# Altium schematic sheet GCMProto.SchDoc
size B; SheetNumber: 1; SheetTotal: 1; SPICEModelCacheAHAKVLQQ: <root> / <DocumentId>AHAKVLQQ</DocumentId> / </root>
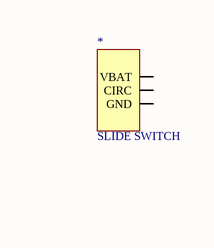
[diagram p0: GCMProto.SchDoc, top right]
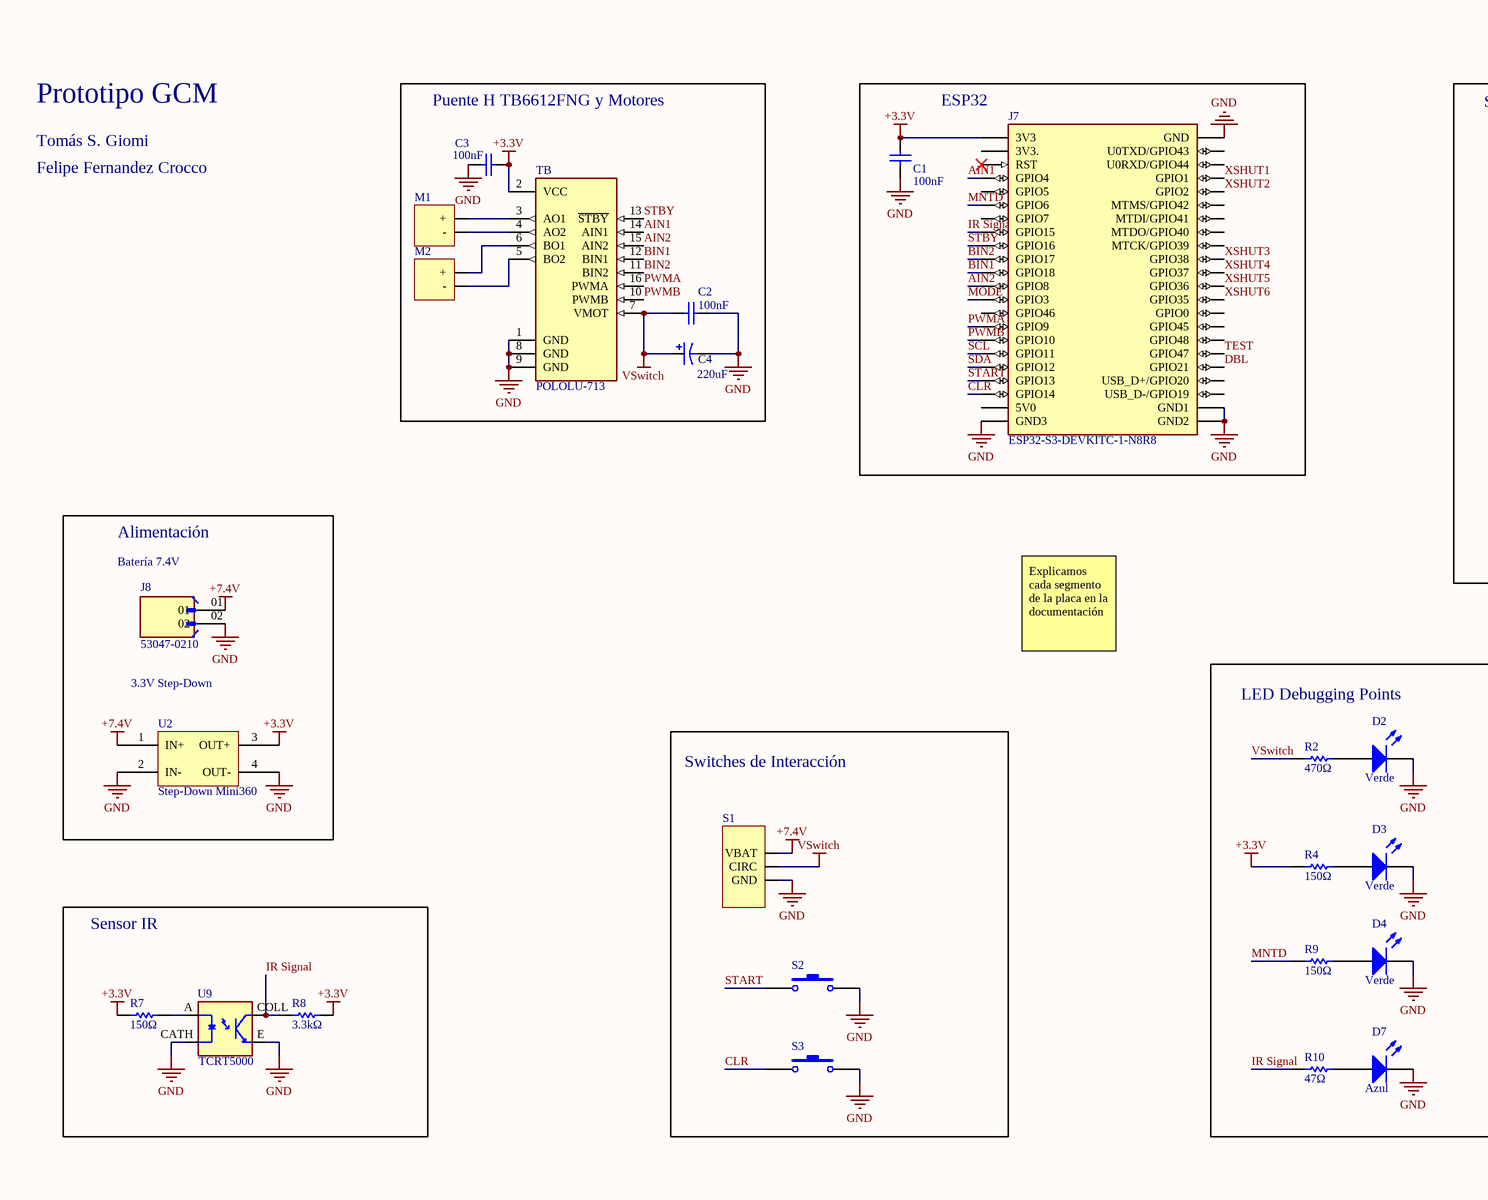
[diagram p1: GCMProto.SchDoc, bottom left]
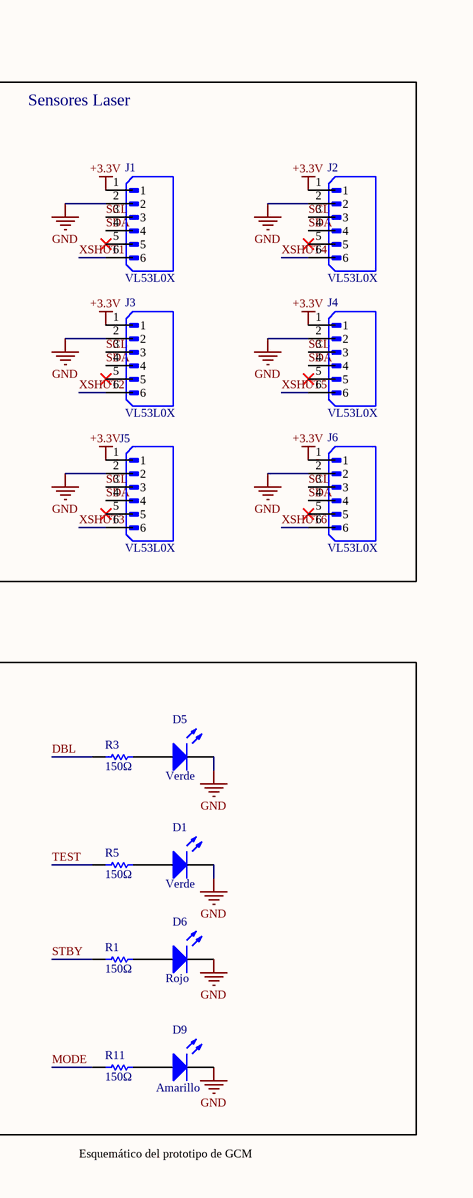
[diagram p2: GCMProto.SchDoc, bottom right]

## Parts
*  SLIDE SWITCH  [Slide Switch]
C1  Cap Ceramico  [Cap Ceramico]  (value not drawn)
C2  100nf  [Cap Ceramico]  (value not drawn)
C3  Cap Ceramico  [Cap Ceramico]  (value not drawn)
C4  220 uF  [Cap El 220 uF]  (value not drawn)
D1  (no value)  [LED]
D2  (no value)  [LED]
D3  (no value)  [LED]
D4  (no value)  [LED]
D5  (no value)  [LED]
D6  (no value)  [LED]
D7  (no value)  [LED]
D9  (no value)  [LED]
J1  VL53L0X  [JST_B6B-PH-K-S(LF)(SN)]
J2  VL53L0X  [JST_B6B-PH-K-S(LF)(SN)]
J3  VL53L0X  [JST_B6B-PH-K-S(LF)(SN)]
J4  VL53L0X  [JST_B6B-PH-K-S(LF)(SN)]
J5  VL53L0X  [JST_B6B-PH-K-S(LF)(SN)]
J6  VL53L0X  [JST_B6B-PH-K-S(LF)(SN)]
J7  ESP32-S3-DEVKITC-1-N8R8  [ESP32-S3-DEVKITC-1-N8R8]
J8  53047-0210  [MOLEX_53047-0210]
M1  (no value)  [MOTOR]
M2  (no value)  [MOTOR]
R1  150Ω  [Res_0.25W]
R2  470Ω  [Res_0.25W]
R3  150Ω  [Res_0.25W]
R4  150Ω  [Res_0.25W]
R5  150Ω  [Res_0.25W]
R7  150Ω  [Res_0.25W]
R8  3.3kΩ  [Res_0.25W]
R9  150Ω  [Res_0.25W]
R10  47Ω  [Res_0.25W]
R11  150Ω  [Res_0.25W]
S1  (no value)  [Slide Switch]
S2  (no value)  [Pulsador]
S3  (no value)  [Pulsador]
TB  POLOLU-713  [SHIELD_POLOLU-713]
U2  Step-Down Mini360  [Step-Down]  (no BOM)
U9  (no value)  [OPTO_TCRT5000]

## Blocks framed on the sheet
Sensores Laser: J1-J6
LED Debugging Points: D1-D7 D9 R1-R5 R9-R11
Switches de Interacción: S1-S3
Sensor IR: R7 R8 U9

## Nets
+3.3V: C1.2 C3.2 J1.1 J2.1 J3.1 J4.1 J5.1 J6.1 J7.J1_1(3V3) R4.1 R7.1 R8.2 TB.2(VCC) U2.3(OUT+)
+7.4V: J8.01 S1.0(VBAT) U2.1(IN+)
GND: C1.1 C2.2 C3.1 C4.2 D1.1(K) D2.1(K) D3.1(K) D4.1(K) D5.1(K) D6.1(K) D7.1(K) D9.1(K) J1.2 J2.2 J3.2 J4.2 J5.2 J6.2 J7.J1_22(GND3) J7.J3_1(GND) J7.J3_21(GND1) J7.J3_22(GND2) J8.02 S1.2(GND) S2.2 S3.2 TB.1(GND) TB.8(GND) TB.9(GND) U2.2(IN-) U2.4(OUT-) U9.CATH U9.E
VSwitch: C2.1 C4.1 R2.1 S1.1(CIRC) TB.7(VMOT)
AIN1: J7.J1_4(GPIO4) TB.14(AIN1)
AIN2: J7.J1_12(GPIO8) TB.15(AIN2)
BIN1: J7.J1_11(GPIO18) TB.12(BIN1)
BIN2: J7.J1_10(GPIO17) TB.11(BIN2)
CLR: J7.J1_20(GPIO14) S3.1
DBL: J7.J3_18(GPIO21) R3.1
IR Signal: J7.J1_8(GPIO15) R8.1 R10.1 U9.COLL
MNTD: J7.J1_6(GPIO6) R9.1
MODE: J7.J1_13(GPIO3) R11.1
PWMA: J7.J1_15(GPIO9) TB.16(PWMA)
PWMB: J7.J1_16(GPIO10) TB.10(PWMB)
SCL: J1.3 J2.3 J3.3 J4.3 J5.3 J6.3 J7.J1_17(GPIO11)
SDA: J1.4 J2.4 J3.4 J4.4 J5.4 J6.4 J7.J1_18(GPIO12)
START: J7.J1_19(GPIO13) S2.1
STBY: J7.J1_9(GPIO16) R1.1 TB.13(~{STBY})
TEST: J7.J3_17(GPIO47) R5.1
XSHUT1: J1.6 J7.J3_4(GPIO1)
XSHUT2: J3.6 J7.J3_5(GPIO2)
XSHUT3: J5.6 J7.J3_10(GPIO38)
XSHUT4: J2.6 J7.J3_11(GPIO37)
XSHUT5: J4.6 J7.J3_12(GPIO36)
XSHUT6: J6.6 J7.J3_13(GPIO35)
NetD1_0: D1.0(A) R5.2
NetD2_0: D2.0(A) R2.2
NetD3_0: D3.0(A) R4.2
NetD4_0: D4.0(A) R9.2
NetD5_0: D5.0(A) R3.2
NetD6_0: D6.0(A) R1.2
NetD7_0: D7.0(A) R10.2
NetD9_0: D9.0(A) R11.2
NetM1_+: M1.+ TB.3(AO1)
NetM1_-: M1.- TB.4(AO2)
NetM2_+: M2.+ TB.6(BO1)
NetM2_-: M2.- TB.5(BO2)
NetR7_2: R7.2 U9.A

Not connected (* = marked no-connect by the designer): * 0(VBAT) 1(CIRC) 2(GND); J1 5*; J2 5*; J3 5*; J4 5*; J5 5*; J6 5*; J7 J1_2(3V3.) J1_3(RST)* J1_5(GPIO5) J1_7(GPIO7) J1_14(GPIO46) J1_21(5V0) J3_2(U0TXD/GPIO43) J3_3(U0RXD/GPIO44) J3_6(MTMS/GPIO42) J3_7(MTDI/GPIO41) J3_8(MTDO/GPIO40) J3_9(MTCK/GPIO39) J3_14(GPIO0) J3_15(GPIO45) J3_16(GPIO48) J3_19(USB_D+/GPIO20) J3_20(USB_D-/GPIO19)

## Notes on the sheet
- Tomás S. Giomi
- Prototipo GCM
- Puente H TB6612FNG y Motores
- (near C3) 100nF
- ESP32
- Felipe Fernandez Crocco
- (near C1) 100nF
- (near C2) 100nF
- (near C4) 220uF
- Alimentación
- (near J8) Batería 7.4V
- 3.3V Step-Down
- Explicamos cada segmento de la placa en la documentación
- (near D2) Verde
- (near D5) Verde
- (near D3) Verde
- (near D1) Verde
- (near D4) Verde
- (near D6) Rojo
- (near U9) TCRT5000
- (near D7) Azul
- (near D9) Amarillo
- Esquemático del prototipo de GCM

## Library data of the parts
C2 = Cap Ceramico
C4 = CAP EL 220 uF
D1-D7 D9 = LED: Published: 8-Jun-2000; LatestRevisionDate: 08-Jul-2005; LatestRevisionNote: Mech Layer 1 removed.; PackageReference: LED-0; Publisher: Altium Limited; PackageDescription: LED; 2 Leads
J1-J6 = B6B-PH-K-S(LF)(SN): MF: {'manufacturer': u'JST Sales America Inc.'}; Package: None; Price: None; Value: *; MP: B6B-PH-K-S(LF)(SN); Availability: Unavailable; LCSC Part Number: C131342
J7 = ESP32-S3-DEVKITC-1-N8R8: The ESP32-S3-DEVKITC-1-N8R8 from Espressif Systems is a development board designed for RF, RFID, and wireless applications. It supports 802.11 b/g/n Wi-Fi and BluetoothÂ® 5.x (BLE) connectivity at 2.4GHz, making it ideal for IoT and wireless communication; SnapEDA_Link: https://www.snapeda.com/parts/ESP32-S3-DEVKITC-1-N8R8/Espressif+Systems/view-part/?ref=snap; Package: None; Value: *; MF: Espressif Systems; MP: ESP32-S3-DEVKITC-1-N8R8; Check_prices: https://www.snapeda.com/parts/ESP32-S3-DEVKITC-1-N8R8/Espressif+Systems/view-part/?ref=eda
J8 = 53047-0210: .049 pitch picoblade wire to board header, vt 2 circuits | Molex Incorporated 53047-0210; SnapEDA_Link: https://www.snapeda.com/parts/53047-0210/Molex/view-part/?ref=snap; Package: None; Value: *; MF: Molex; MP: 53047-0210; Check_prices: https://www.snapeda.com/parts/53047-0210/Molex/view-part/?ref=eda
M1 M2 = POLOLU: LatestRevisionDate: 17-Jul-2002; LatestRevisionNote: Re-released for DXP Platform.; Publisher: Altium Limited
R1-R5 R7-R11 = Res Real: Resistor; Published: 8-Jun-2000; LatestRevisionDate: 17-Jul-2002; LatestRevisionNote: Re-released for DXP Platform.; PackageReference: AXIAL-0.3; Publisher: Altium Limited; PackageDescription: Axial Device, Thru-Hole; 2 Leads; 0.3 in Pin Spacing
S1 = SLIDE SWITCH
S2 S3 = Pulador
TB = POLOLU-713: DC-motor driver; IC: TB6612FNG; 100kHz; 1A; Uin mot: 4.5; MF: Pololu; SnapEDA_Link: https://www.snapeda.com/parts/POLOLU-713/Pololu/view-part/53073/?ref=snap; MP: POLOLU-713; Price: None; Value: *; Availability: Unavailable; Package: None
U2 = Step-Down
U9 = TCRT5000: 950 nm 60 mA Through Hole Reflective Optical Sensor with Transistor Output; Availability: Unavailable; MP: TCRT5000; Value: *; Price: None; Package: None